# EAGLE design nceubadge (EAGLE 7.7.0)
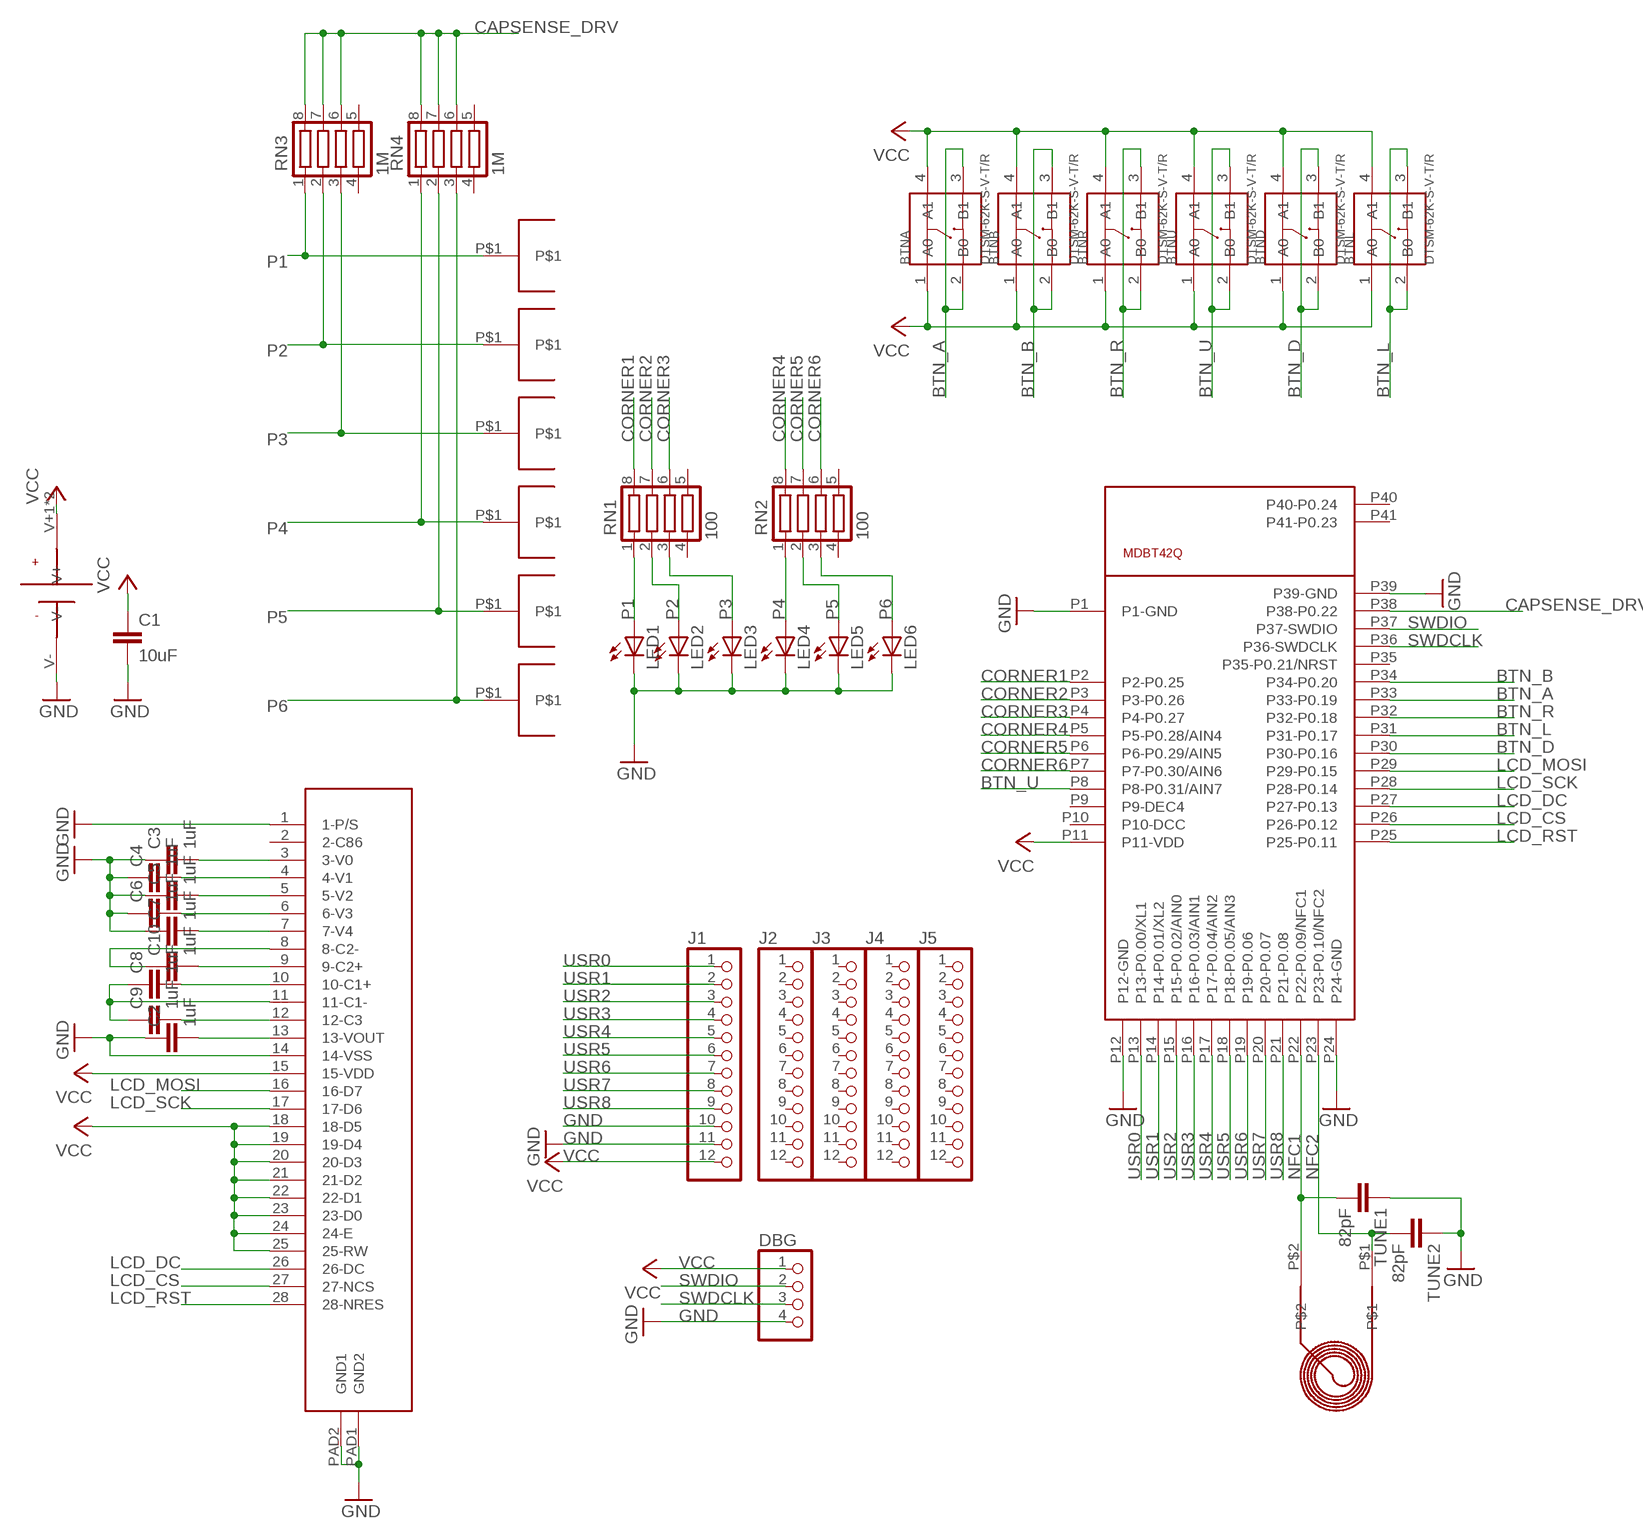
[diagram p0: schematic, sheet 1]

## Parts
BTNA  DTSM-62K-S-V-T/R  SMD-SWITCH-TACTILE-SPST-NO(4P-D6.0MM)  [SW4-SMD-6.0X6.0X5.0MM]
BTNB  DTSM-62K-S-V-T/R  SMD-SWITCH-TACTILE-SPST-NO(4P-D6.0MM)  [SW4-SMD-6.0X6.0X5.0MM]
BTND  DTSM-62K-S-V-T/R  SMD-SWITCH-TACTILE-SPST-NO(4P-D6.0MM)  [SW4-SMD-6.0X6.0X5.0MM]
BTNL  DTSM-62K-S-V-T/R  SMD-SWITCH-TACTILE-SPST-NO(4P-D6.0MM)  [SW4-SMD-6.0X6.0X5.0MM]
BTNR  DTSM-62K-S-V-T/R  SMD-SWITCH-TACTILE-SPST-NO(4P-D6.0MM)  [SW4-SMD-6.0X6.0X5.0MM]
BTNU  DTSM-62K-S-V-T/R  SMD-SWITCH-TACTILE-SPST-NO(4P-D6.0MM)  [SW4-SMD-6.0X6.0X5.0MM]
C1  10uF  C-EUC0805K  [C0805K]
C2  1uF  C-EUC0603  [C0603]
C3  1uF  C-EUC0603  [C0603]
C4  1uF  C-EUC0603  [C0603]
C5  1uF  C-EUC0603  [C0603]
C6  1uF  C-EUC0603  [C0603]
C7  1uF  C-EUC0603  [C0603]
C8  1uF  C-EUC0603  [C0603]
C9  1uF  C-EUC0603  [C0603]
C10  1uF  C-EUC0603  [C0603]
DBG  PINHD-1X4  [1X04]
J1  PINHD-1X12_2.54-S  [1X12-S]
J2  PINHD-1X12_2.54-S  [1X12-S]
J3  PINHD-1X12_2.54-S  [1X12-S]
J4  PINHD-1X12_2.54-S  [1X12-S]
J5  PINHD-1X12_2.54-S  [1X12-S]
J8  KEYSTONE-3003  [KEYSTONE-3003]
LCD  MCCOG128064B12W  [MCOG128064B12W-SPR]
LED1  LED5MM  [LED5MM]
LED2  LED5MM  [LED5MM]
LED3  LED5MM  [LED5MM]
LED4  LED5MM  [LED5MM]
LED5  LED5MM  [LED5MM]
LED6  LED5MM  [LED5MM]
RN1  100  CTS742C083  [CTS742C083]
RN2  100  CTS742C083  [CTS742C083]
RN3  1M  CTS742C083  [CTS742C083]
RN4  1M  CTS742C083  [CTS742C083]
TUNE1  82pF  C-EUC0603  [C0603]
TUNE2  82pF  C-EUC0603  [C0603]
U1  MDBT42Q  [MDBT40]
U$2  BANANAPLUG  [BANANAPLUG]
U$3  BANANAPLUG  [BANANAPLUG]
U$4  BANANAPLUG  [BANANAPLUG]
U$5  BANANAPLUG  [BANANAPLUG]
U$6  BANANAPLUG  [BANANAPLUG]
U$7  BANANAPLUG  [BANANAPLUG]
U$8  NFC  [NFC]

## Nets
BTN_A: BTNA.2(B0) BTNA.3(B1) U1.P33(P33-P0.19)
BTN_B: BTNB.2(B0) BTNB.3(B1) U1.P34(P34-P0.20)
BTN_D: BTND.2(B0) BTND.3(B1) U1.P30(P30-P0.16)
BTN_L: BTNL.2(B0) BTNL.3(B1) U1.P31(P31-P0.17)
BTN_R: BTNR.2(B0) BTNR.3(B1) U1.P32(P32-P0.18)
BTN_U: BTNU.2(B0) BTNU.3(B1) U1.P8(P8-P0.31/AIN7)
CAPSENSE_DRV: RN3.6 RN3.7 RN3.8 RN4.6 RN4.7 RN4.8 U1.P38(P38-P0.22)
CORNER1: RN1.8 U1.P2(P2-P0.25)
CORNER2: RN1.7 U1.P3(P3-P0.26)
CORNER3: RN1.6 U1.P4(P4-P0.27)
CORNER4: RN2.8 U1.P5(P5-P0.28/AIN4)
CORNER5: RN2.7 U1.P6(P6-P0.29/AIN5)
CORNER6: RN2.6 U1.P7(P7-P0.30/AIN6)
GND: C1.2 C2.1 C3.1 C4.1 C5.1 C6.1 C7.1 DBG.4 J1.10 J1.11 J8.V- LCD.1(1-P/S) LCD.14(14-VSS) LCD.PAD1(GND2) LCD.PAD2(GND1) LED1.K(C) LED2.K(C) LED3.K(C) LED4.K(C) LED5.K(C) LED6.K(C) TUNE1.1 TUNE2.1 U1.P1(P1-GND) U1.P12(P12-GND) U1.P24(P24-GND) U1.P39(P39-GND)
LCD_CS: LCD.27(27-NCS) U1.P26(P26-P0.12)
LCD_DC: LCD.26(26-DC) U1.P27(P27-P0.13)
LCD_MOSI: LCD.16(16-D7) U1.P29(P29-P0.15)
LCD_RST: LCD.28(28-NRES) U1.P25(P25-P0.11)
LCD_SCK: LCD.17(17-D6) U1.P28(P28-P0.14)
N$12: C8.1 C9.1 LCD.11(11-C1-)
N$13: C8.2 LCD.10(10-C1+)
N$14: C9.2 LCD.12(12-C3)
N$15: C2.2 LCD.13(13-VOUT)
N$16: C7.2 LCD.7(7-V4)
N$17: C6.2 LCD.6(6-V3)
N$18: C5.2 LCD.5(5-V2)
N$19: C4.2 LCD.4(4-V1)
N$20: C3.2 LCD.3(3-V0)
N$23: C10.2 LCD.9(9-C2+)
N$24: C10.1 LCD.8(8-C2-)
NFC1: TUNE1.2 U1.P22(P22-P0.09/NFC1) U$8.P$2
NFC2: TUNE2.2 U1.P23(P23-P0.10/NFC2) U$8.P$1
P1: LED1.A RN1.1 RN3.1 U$6.P$1
P2: LED2.A RN1.2 RN3.2 U$7.P$1
P3: LED3.A RN1.3 RN3.3 U$5.P$1
P4: LED4.A RN2.1 RN4.1 U$4.P$1
P5: LED5.A RN2.2 RN4.2 U$3.P$1
P6: LED6.A RN2.3 RN4.3 U$2.P$1
SWDCLK: DBG.3 U1.P36(P36-SWDCLK)
SWDIO: DBG.2 U1.P37(P37-SWDIO)
USR0: J1.1 U1.P13(P13-P0.00/XL1)
USR1: J1.2 U1.P14(P14-P0.01/XL2)
USR2: J1.3 U1.P15(P15-P0.02/AIN0)
USR3: J1.4 U1.P16(P16-P0.03/AIN1)
USR4: J1.5 U1.P17(P17-P0.04/AIN2)
USR5: J1.6 U1.P18(P18-P0.05/AIN3)
USR6: J1.7 U1.P19(P19-P0.06)
USR7: J1.8 U1.P20(P20-P0.07)
USR8: J1.9 U1.P21(P21-P0.08)
VCC: BTNA.1(A0) BTNA.4(A1) BTNB.1(A0) BTNB.4(A1) BTND.1(A0) BTND.4(A1) BTNL.1(A0) BTNL.4(A1) BTNR.1(A0) BTNR.4(A1) BTNU.1(A0) BTNU.4(A1) C1.1 DBG.1 J1.12 J8.V+1(V+) J8.V+2(V+) LCD.15(15-VDD) LCD.18(18-D5) LCD.19(19-D4) LCD.20(20-D3) LCD.21(21-D2) LCD.22(22-D1) LCD.23(23-D0) LCD.24(24-E) LCD.25(25-RW) U1.P11(P11-VDD)
Unconnected: J2.1 J2.2 J2.3 J2.4 J2.5 J2.6 J2.7 J2.8 J2.9 J2.10 J2.11 J2.12 J3.1 J3.2 J3.3 J3.4 J3.5 J3.6 J3.7 J3.8 J3.9 J3.10 J3.11 J3.12 J4.1 J4.2 J4.3 J4.4 J4.5 J4.6 J4.7 J4.8 J4.9 J4.10 J4.11 J4.12 J5.1 J5.2 J5.3 J5.4 J5.5 J5.6 J5.7 J5.8 J5.9 J5.10 J5.11 J5.12 LCD.2(2-C86) RN1.4 RN1.5 RN2.4 RN2.5 RN3.4 RN3.5 RN4.4 RN4.5 U1.P9(P9-DEC4) U1.P10(P10-DCC) U1.P35(P35-P0.21/NRST) U1.P40(P40-P0.24) U1.P41(P41-P0.23)

## Library data of the parts
BTNA BTNB BTND BTNL BTNR BTNU = Seeed-OPL-Button:SMD-SWITCH-TACTILE-SPST-NO(4P-D6.0MM): 311020004; MPN: DTSM-62K-S-V-T/R
C1-C10 TUNE1 TUNE2 = rcl:C-EU: CAPACITOR, European symbol
DBG = pinhead:PINHD-1X4: PIN HEADER
J1-J5 = pinhead-2:PINHD-1X12: PIN HEADER
J8 = cr2032:KEYSTONE-3003
LCD = midas:MCCOG128064B12W
LED1-LED6 = led:LED: LED OSRAM: - CHIPLED LG R971, LG N971, LY N971, LG Q971, LY Q971, LO R971, LY R971 LH N974, LH R974 LS Q976, LO Q976, LY Q976 LO Q996 - Hyper CHIPLED LW Q18S LB Q993, LB Q99A, LB R99A - SideLED LS A670, LO A670, LY A670, LG A670, LP A670 LB A673, LV A673, LT A673, LW A673 LH A674 LY A675 LS A676, LA A676, LO A676, LY A676, LW A676 LS A679, LY A679, LG A679 - Hyper Micro SIDELED® LS Y876, LA Y876, LO Y876, LY Y876 LT Y87S - SmartLED LW L88C, LW L88S LB L89C, LB L89S, LG L890 LS L89K, LO L89K, LY L89K LS L896, LA L896, LO L896, LY L896 - TOPLED LS T670, LO T670, LY T670, LG T670, LP T670 LSG T670, LSP T670, LSY T670, LOP T670, LYG T670 LG T671, LOG T671, LSG T671 LB T673, LV T673, LT T673, LW T673 LH T674 LS T676, LA T676, LO T676, LY T676, LB T676, LH T676, LSB T676, LW T676 LB T67C, LV T67C, LT T67C, LS T67K, LO T67K, LY T67K, LW E67C LS E67B, LA E67B, LO E67B, LY E67B, LB E67C, LV E67C, LT E67C LW T67C LS T679, LY T679, LG T679 LS T770, LO T770, LY T770, LG T770, LP T770 LB T773, LV T773, LT T773, LW T773 LH T774 LS E675, LA E675, LY E675, LS T675 LS T776, LA T776, LO T776, LY T776, LB T776 LHGB T686 LT T68C, LB T68C - Hyper Mini TOPLED® LB M676 - Mini TOPLED Santana® LG M470 LS M47K, LO M47K, LY M47K Source: http://www.osram.convergy.de LUXEON: - LUMILED® LXK2-PW12-R00, LXK2-PW12-S00, LXK2-PW14-U00, LXK2-PW14-V00 LXK2-PM12-R00, LXK2-PM12-S00, LXK2-PM14-U00 LXK2-PE12-Q00, LXK2-PE12-R00, LXK2-PE12-S00, LXK2-PE14-T00, LXK2-PE14-U00 LXK2-PB12-K00, LXK2-PB12-L00, LXK2-PB12-M00, LXK2-PB14-N00, LXK2-PB14-P00, LXK2-PB14-Q00 LXK2-PR12-L00, LXK2-PR12-M00, LXK2-PR14-Q00, LXK2-PR14-R00 LXK2-PD12-Q00, LXK2-PD12-R00, LXK2-PD12-S00 LXK2-PH12-R00, LXK2-PH12-S00 LXK2-PL12-P00, LXK2-PL12-Q00, LXK2-PL12-R00 Source: www.luxeon.com KINGBRIGHT: KA-3528ASYC Source: www.kingbright.com
RN1-RN4 = resistor-net:CTS742C083: Chip Resistor Array 4 Single Resistor Source: http://www.ctscorp.com/components/Datasheets/CTSChipArrayDs.pdf; OC_FARNELL: unknown; OC_NEWARK: unknown
U1 = mdbt42:MDBT42Q
U$2-U$7 = bananaplug:BANANAPLUG
U$8 = nfc:NFC

## Board
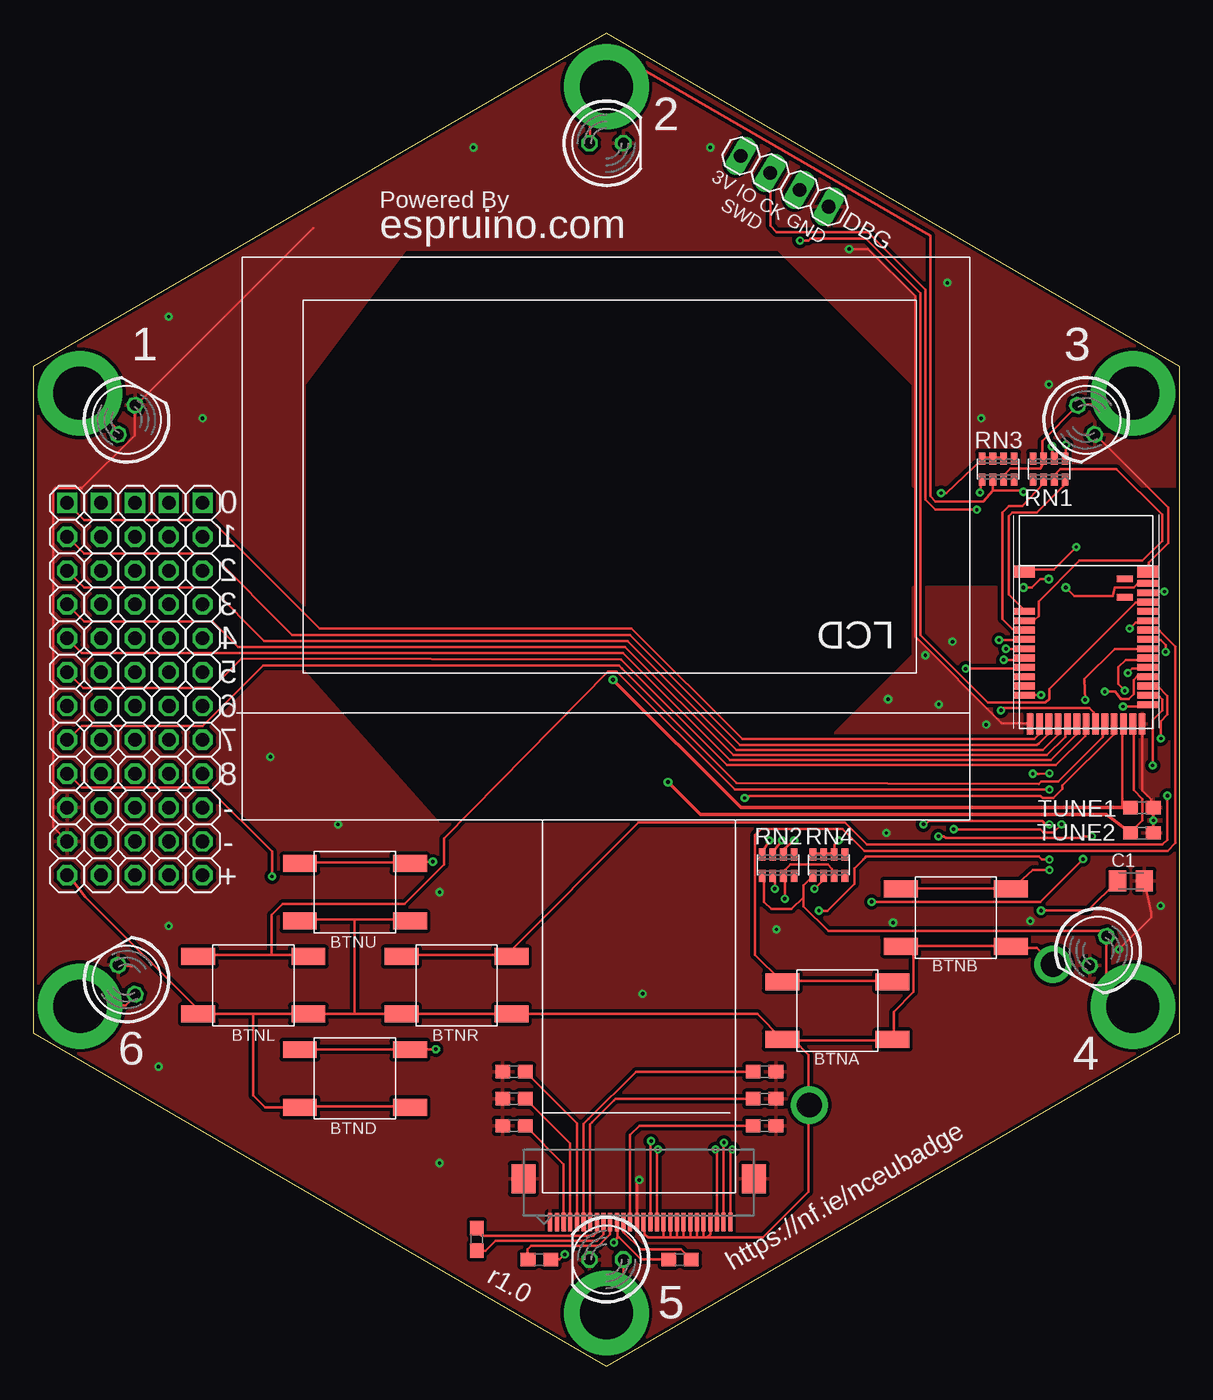
[diagram p1: board, top side]
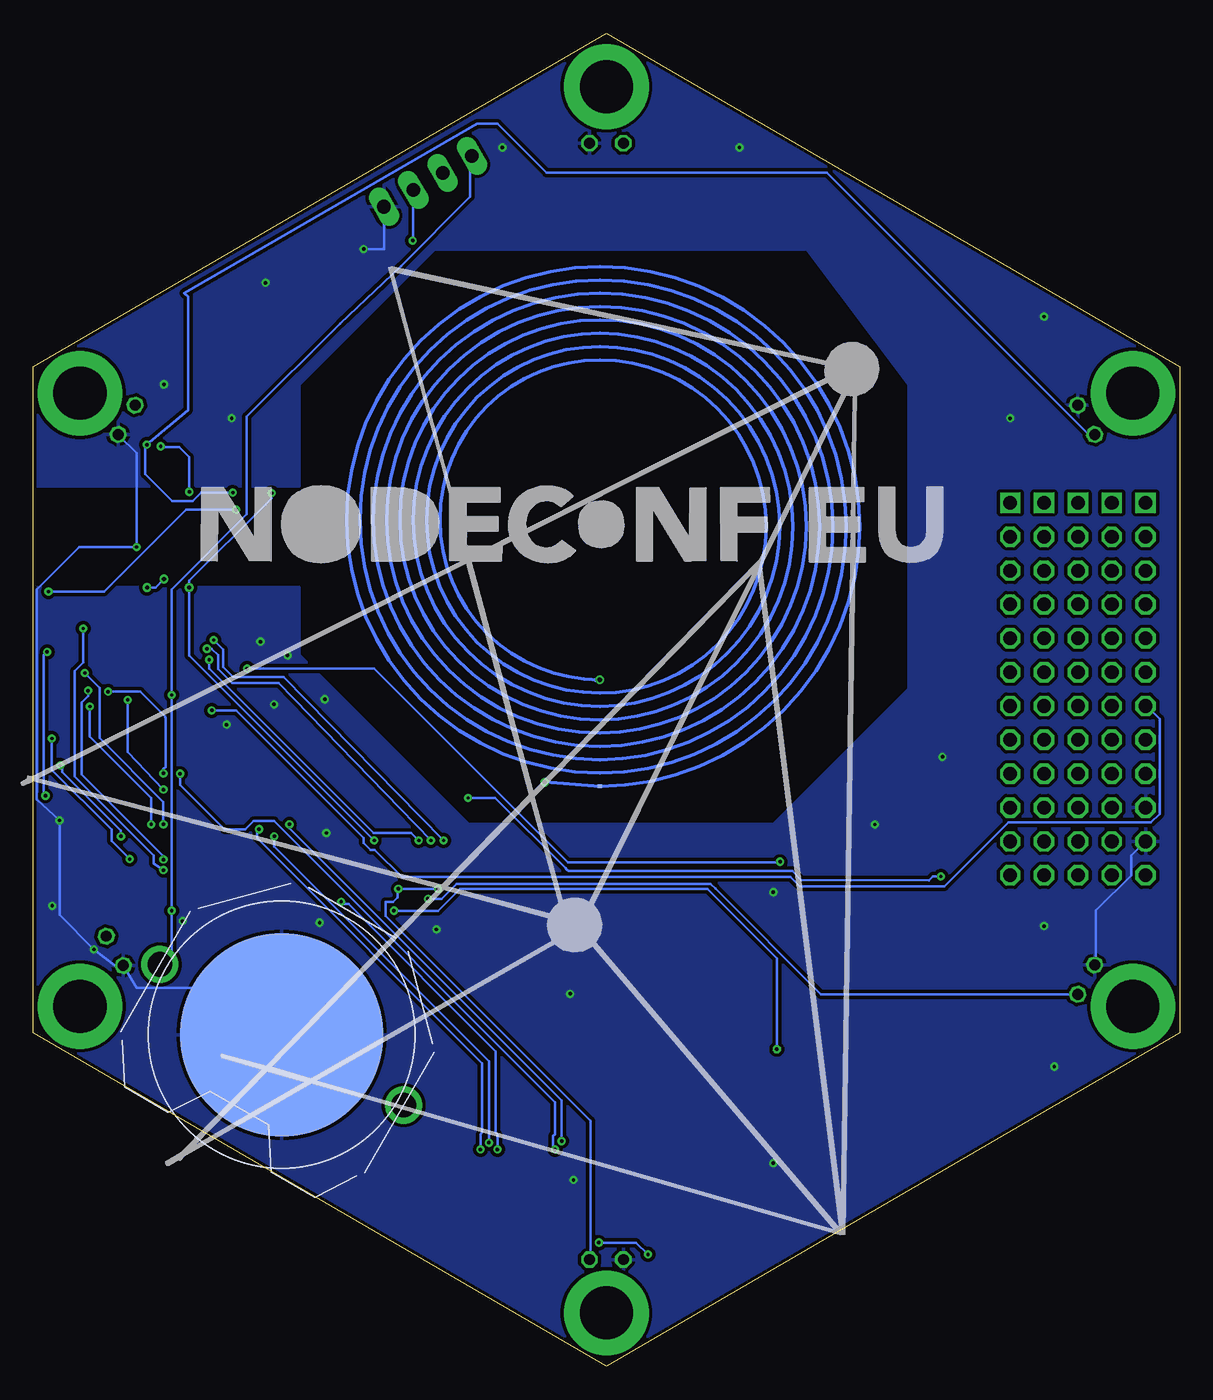
[diagram p2: board, bottom side, seen from below]

Size 86 x 100 mm. Coordinates in mm from the lower left corner, seen from the top.
Outline: 43,0 86,25 86,75 43,100 0,75 0,25 43,0
Copper layers (1*16): Top 0.035559375mm / dielectric 0.17018125mm / Bottom 0.035559375mm
Design rules "espruino *": minimum track width 8mil, minimum drill 10mil, track to track 6mil, track to pad 6mil, pad to pad 6mil, via to via 6mil, smd to smd 0mil, copper to edge 6mil, drill to drill 6mil, minimum pad ring 7mil, minimum via ring 7mil, stop-mask expansion 6mil, vias tented up to drill 15mil, thermal gap 10mil

### Footprints (pad centres in the part's own frame; a part is rotated, then mirrored left to right if it is on the bottom)
SW4-SMD-6.0X6.0X5.0MM = smd 2.54 x 1.27: 1 -4.129,2.159; 2 -4.129,-2.159; 3 4.129,-2.159; 4 4.129,2.159
C0805K = smd 1.3 x 1.6: 1 -1,0; 2 1,0
C0603 = smd 1.1 x 1: 1 -0.85,0; 2 0.85,0
1X04 = drill 1.016 long: 1 -3.81,0; 2 -1.27,0; 3 1.27,0; 4 3.81,0
1X12-S = drill 1.016 square: 1 -13.97,0 | drill 1.016 octagon: 2 -11.43,0; 3 -8.89,0; 4 -6.35,0; 5 -3.81,0; 6 -1.27,0; 7 1.27,0; 8 3.81,0; 9 6.35,0; 10 8.89,0; 11 11.43,0; 12 13.97,0
KEYSTONE-3003 = drill 1.854: V+1 -10.554,0; V+2 10.554,0 | smd 15.24 x 15.24: V- 0,0
MCOG128064B12W-SPR = smd 0.305 x 1.397: 1 31.466,30.191; 2 30.958,30.191; 3 30.45,30.191; 4 29.968,30.191; 5 29.46,30.191; 6 28.952,30.191; 7 28.469,30.191; 8 27.961,30.191; 9 27.453,30.191; 10 26.971,30.191; 11 26.463,30.191; 12 25.955,30.191; 13 25.472,30.191; 14 24.964,30.191; 15 24.456,30.191; 16 23.948,30.191; 17 23.465,30.191; 18 22.957,30.191; 19 22.449,30.191; 20 21.967,30.191; 21 21.459,30.191; 22 20.951,30.191; 23 20.468,30.191; 24 19.96,30.191; 25 19.452,30.191; 26 18.97,30.191; 27 18.462,30.191; 28 17.954,30.191 | smd 1.8 x 2.2: PAD1 16.17,26.94; PAD2 33.47,26.94
LED5MM = drill 0.813 octagon: A -1.27,0; K 1.27,0
CTS742C083 = smd 0.5 x 0.9: 1 -1.2,-0.8; 2 -0.4,-0.8; 3 0.4,-0.8; 4 1.2,-0.8; 5 1.2,0.8; 6 0.4,0.8; 7 -0.4,0.8; 8 -1.2,0.8
MDBT40 = smd 1.6 x 0.9: P1 -4.65,3.8; P39 4.65,3.8 | smd 1.6 x 0.5: P2 -4.65,0.8; P3 -4.65,0.1; P4 -4.65,-0.6; P5 -4.65,-1.3; P6 -4.65,-2; P7 -4.65,-2.7; P8 -4.65,-3.4; P9 -4.65,-4.1; P10 -4.65,-4.8; P11 -4.65,-5.5; P25 4.65,-6.2; P26 4.65,-5.5; P27 4.65,-4.8; P28 4.65,-4.1; P29 4.65,-3.4; P30 4.65,-2.7; P31 4.65,-2; P32 4.65,-1.3; P33 4.65,-0.6; P34 4.65,0.1; P35 4.65,0.8; P36 4.65,1.5; P37 4.65,2.2; P38 4.65,2.9 | smd 0.5 x 1.6: P12 -4.2,-7.65; P13 -3.5,-7.65; P14 -2.8,-7.65; P15 -2.1,-7.65; P16 -1.4,-7.65; P17 -0.7,-7.65; P18 0,-7.65; P19 0.7,-7.65; P20 1.4,-7.65; P21 2.1,-7.65; P22 2.8,-7.65; P23 3.5,-7.65; P24 4.2,-7.65 | smd 1.2 x 0.5: P40 2.9,3.25; P41 2.9,1.85
BANANAPLUG = drill 4 pad 6.35: P$1 0,0
NFC = smd 0.305 x 0.254: P$1 0,-20; P$2 0,-12

### Placement (x,y rotation side)
BTNA  60.33,26.67 180 top
BTNB  69.22,33.66 180 top
BTND  24.13,21.59 180 top
BTNL  16.51,28.57 180 top
BTNR  31.75,28.57 180 top
BTNU  24.13,35.56 180 top
C1  82.35,36.41 0 top
C2  54.86,18.03 180 top
C3  36.07,18.03 0 top
C4  36.07,20.07 0 top
C5  36.07,22.1 0 top
C6  54.86,22.1 180 top
C7  54.86,20.07 180 top
C8  37.97,8 180 top
C9  48.51,8 0 top
C10  33.27,9.53 270 top
DBG  56.39,88.9 330 top
J1  2.54,50.8 270 top
J2  5.08,50.8 270 top
J3  7.62,50.8 270 top
J4  10.16,50.8 270 top
J5  12.7,50.8 270 top
J8  67.36,24.86 330 bottom
LCD  70.25,41 180 top
LED1  7,71 60 top
LED2  43,91.75 0 top
LED3  79,71 300 top
LED4  79.89,31.16 240 top
LED5  43,8 180 top
LED6  7,29 120 top
RN1  76.2,67.31 180 top
RN2  55.88,37.59 0 top
RN3  72.39,67.31 0 top
RN4  59.69,37.59 0 top
TUNE1  83.19,41.91 180 top
TUNE2  83.19,40.01 180 top
U1  78.99,55.83 0 top
U$2  3.5,27 0 top
U$3  43,4 0 top
U$4  82.5,27 0 top
U$5  82.5,73 0 top
U$6  3.5,73 0 top
U$7  43,96 0 top
U$8  43.5,63.5 0 bottom

### Tracks (layer width: path | path; a pad name or v marks a point on that pad's centre or on a via)
BTN_A
  Top 0.203: U1.P33 83.71,55.14 84.53,55.14 85.69,53.99 85.69,39.24 85.11,38.67 62.37,38.67 60.72,40.32 54.63,40.32 54.15,39.84 54.15,30.87 56.13,28.89 BTNA.3 56.3,28.89 64.39,28.89 BTNA.2
BTN_B  (via drill 0.25)
  Top 0.203: v82.26,55.35 82.72,55.8 83.54,55.8 U1.P34 | v76.24,37.22 74.99,37.22 73.47,35.83 BTNB.2 73.3,35.83 65.22,35.83 BTNB.3
  Bottom 0.203: v82.26,55.35 82.26,52.79 82.88,52.17 82.88,44.25 76.96,38.33 76.96,37.72 76.24,37.25 v76.24,37.22
BTN_D  (via drill 0.25)
  Top 0.203: v76.24,38.01 75.65,38.01 75.44,38.23 62.48,38.23 62.4,38.14 62.29,38.04 61.59,37.34 61.59,36.2 59.56,34.16 58.95,34.16 v58.94,34.18 | U1.P30 83.54,53 81.95,53 81.41,52.45 81.41,51.17 v81.89,50.69 | BTND.3 20.47,23.77 27.74,23.77 27.76,23.75 BTND.2 28.28,23.77 v30.21,23.77
  Bottom 0.203: v81.89,50.69 81.89,50.28 82.39,49.78 82.39,44.41 76.24,38.27 v76.24,38.01 | v30.21,23.77 30.21,30.59 35.43,35.81 53.98,35.81 55.63,34.16 58.93,34.16 v58.94,34.18
BTN_L  (via drill 0.25)
  Top 0.203: v78.92,49.99 78.87,51.56 81.13,53.82 83.54,53.82 U1.P31 | v76.24,43.26 52.63,43.26 43.75,52.13 43.13,52.13 30.84,39.59 30.84,37.66 27.85,34.67 18.71,34.67 17.88,33.85 17.88,30.87 | BTNL.2 20.14,30.87 17.88,30.87 | 17.88,30.87 12.88,30.87 BTNL.3
  Bottom 0.203: v78.92,49.99 78.92,46.06 v76.24,43.26
BTN_R  (via drill 0.25)
  Top 0.203: U1.P32 83.71,54.48 84.58,54.48 84.96,54.1 v84.96,53.59 | BTNR.3 28.07,30.87 35.33,30.87 BTNR.2 35.5,30.87 45.4,40.78 60.88,40.78 62.53,39.13 84.72,39.13 85.09,39.5 v85.09,42.8
  Bottom 0.203: v84.96,53.59 85.22,53.34 85.22,42.93 v85.09,42.8
BTN_U  (via drill 0.25)
  Top 0.203: v69.96,52.34 74.3,52.34 U1.P8 | BTNU.3 20.47,37.81 28.17,37.81 BTNU.2 28.39,37.85 v29.97,37.85
  Bottom 0.203: v69.96,52.34 60.43,52.34 45.9,37.81 30.01,37.81 v29.97,37.85
CAPSENSE_DRV  (via drill 0.25, 0.3)
  Top 0.203: RN4.8 58.61,38.46 59.27,38.46 RN4.7 59.44,38.46 59.93,38.46 RN4.6 60.1,38.46 60.1,39.12 v60.43,39.45 | RN3.6 72.64,68.19 72.15,68.19 RN3.7 71.98,68.19 71.32,68.19 RN3.8 71.16,68.02 68.52,65.51 v68.11,65.51 | U1.P38 82.86,58.73 82.55,58.42 81.15,58.42 80.97,57.78 78.11,57.78 v77.47,58.42 | v76.2,59.05 75.56,59.05 74.93,58.42 v74.3,58.42
  Bottom 0.203: v68.11,65.51 68.11,65.11 68.58,64.64 74.3,58.94 v74.3,58.42 74.3,53.31 v60.43,39.45 | v77.47,58.42 76.83,58.42 v76.2,59.05
CORNER1
  Top 0.203: RN1.8 77.27,66.37 77.27,66.04 75.29,64.06 73.47,64.06 73.18,63.77 73.18,57.91 74.3,56.79 U1.P2
CORNER2
  Top 0.203: RN1.7 76.61,66.53 76.61,66.86 77.06,67.32 81.27,67.32 84.7,63.89 84.7,61.91 83.21,60.43 78.5,60.43 75.45,57.38 75.45,56.3 75.12,55.97 74.46,55.97 U1.P3
CORNER3
  Top 0.203: RN1.6 75.78,66.37 75.78,66.2 74.22,64.52 73.18,64.52 72.72,64.06 72.72,56.06 73.47,55.31 74.3,55.31 U1.P4
CORNER4  (via drill 0.25)
  Top 0.203: v55.22,39.45 54.81,38.79 54.81,38.46 RN2.8 | v72.47,54.48 74.3,54.48 U1.P5
  Bottom 0.203: v55.22,39.45 67.23,51.71 71.02,51.71 71.75,52.45 71.75,53.77 v72.47,54.48
CORNER5  (via drill 0.25)
  Top 0.203: v56.17,39.45 55.64,38.79 55.64,38.46 RN2.7 | v72.97,53.82 74.3,53.82 U1.P6
  Bottom 0.203: v56.17,39.45 67.6,51.26 71.07,51.26 72.14,52.32 72.14,53.34 72.62,53.82 v72.97,53.82
CORNER6  (via drill 0.25)
  Top 0.203: v57.09,39.45 56.3,38.79 56.3,38.46 RN2.6 | v72.81,53 74.3,53 U1.P7
  Bottom 0.203: v57.09,39.45 57.65,40.01 60.45,40.01 72.81,52.36 v72.81,53
GND  (via drill 0.25)
  Top 0.203: U1.P12 74.62,48.21 72.64,48.26 66.17,54.74 66.17,80.26 62.61,83.82 v61.21,83.82 | 44.41,91.63 LED2.K | J1.11 2.48,39.46 1.49,40.45 1.49,65.71 1.65,65.88 3.63,65.88 7.59,69.84 7.59,71.98 LED1.K 7.76,72.15 21,85.38 | v78.26,61.45 76.57,59.77 74.46,59.77 U1.P1 | U1.P39 83.71,59.77 83.71,60.3 85.15,61.75 85.15,64.43 79.74,69.84 LED3.K | TUNE2.1 84.04,40.12 v84.04,40.95 84.04,41.77 TUNE1.1 83.87,41.94 83.87,42.52 83.21,43.18 83.21,48.04 U1.P24 | v81.46,31.27 83.87,33.68 83.87,34.01 C1.2 | 79.15,30.18 LED4.K | 7.43,30.05 6.44,30.05 LED6.K | LCD.14 45.29,13.79 v45.47,13.97
  Bottom 0.203: LED6.K 6.27,30.21 6.27,34.18 3.63,36.82 3.63,38.3 2.64,39.29 J1.11 | LED3.K 79.58,69.84 78.26,68.52 v78.26,61.45 82.56,61.45 85.74,58.28 85.74,42.52 v84.04,40.95 84.04,33.85 v81.46,31.27 79.9,30.09 79.57,30.09 LED4.K 78.26,28.4 70.99,28.4 67.53,24.93 J8.V- | v61.21,83.82 59.69,83.82 DBG.4
  other vias: 76.2,73.66 68.58,81.28 71.12,71.12 50.8,91.44 33.02,91.44 12.7,71.12 10.16,78.74 17.78,45.72 22.86,40.64 30.48,35.56 45.72,27.94 30.48,15.24 10.16,33.02 68.96,54.36 64.14,50.04 67.94,49.66 71.5,48.13 64.01,40.01 55.75,32.77 64.52,33.27 66.93,53.34 74.8,33.4 84.58,34.54 9.4,22.48
  pour Bottom (isolate 0.254): -5.71,100.97 88.9,100.97 88.9,66.04 66.04,66.04 66.04,73.66 55.88,83.82 27.94,83.82 20.32,73.66 20.32,50.8 30.48,40.64 53.34,40.64 66.04,53.34 66.04,58.42 88.9,58.42 88.9,-3.81 -5.71,-3.81
  pour Top (isolate 0.254): -5.71,100.97 88.9,100.97 88.9,66.04 66.04,66.04 66.04,73.66 55.88,83.82 27.94,83.82 20.32,73.66 20.32,52.07 30.48,40.64 53.34,40.64 66.04,53.34 66.04,58.42 88.9,58.42 88.9,-3.81 -5.71,-3.81
LCD_CS  (via drill 0.25)
  Top 0.203: v79.43,39.75 78.87,39.75 78.74,39.62 68.45,39.62 68.33,39.75 v67.92,39.75 | v83.98,45.07 83.98,48.49 84.7,49.2 84.7,50.02 84.53,50.19 83.71,50.19 U1.P26 | LCD.27 51.79,16.74 v51.82,16.76
  Bottom 0.203: v51.82,16.76 51.82,22.86 67.94,38.99 67.94,39.6 v67.92,39.75 | v79.43,39.75 79.43,40.18 83.82,44.58 83.82,44.91 v83.98,45.07
LCD_DC  (via drill 0.25)
  Top 0.203: v62.9,34.84 75.55,34.84 v78.77,38.05 | v84.61,47.09 84.58,48.39 85.09,48.9 85.09,50.29 84.37,51.02 83.71,51.02 U1.P27 | LCD.26 51.28,16.23 v51.18,16.26
  Bottom 0.203: v51.18,16.26 51.18,17.4 51.31,17.53 51.31,23.62 62.36,34.67 62.74,34.67 v62.9,34.84 | v84.61,47.09 84.61,44.73 80.14,40.26 80.14,39.42 v78.77,38.05
LCD_MOSI  (via drill 0.25)
  Top 0.203: v76.24,40.65 75.93,40.65 75.69,40.89 67.18,40.89 66.94,40.65 v66.79,40.65 | v82.13,52.01 82.46,52.34 83.54,52.34 U1.P29 | LCD.16 46.3,16.84 v46.35,16.89
  Bottom 0.203: v76.24,40.65 76.24,42.34 81.01,47.12 81.01,50.89 v82.13,52.01 | v46.35,16.89 46.35,19.94 66.79,40.37 v66.79,40.65
LCD_RST  (via drill 0.25)
  Top 0.203: v69.06,40.28 69.75,40.28 69.85,40.26 75.56,40.26 75.79,40.03 76.53,40.03 v77.15,40.65 | v81.76,49.49 83.38,49.49 83.54,49.53 U1.P25 | LCD.28 52.3,16.23 v52.45,16.26
  Bottom 0.203: v77.15,40.65 77.15,42.63 81.76,47.24 v81.76,49.49 | v52.45,16.26 52.45,17.4 52.32,17.53 52.32,22.73 69.22,39.62 69.22,40.26 v69.06,40.28
LCD_SCK  (via drill 0.25)
  Top 0.203: v74.99,44.45 75.45,44.45 v76.24,44.48 | v80.39,50.61 81.18,50.61 81.6,50.06 82.18,50.06 82.55,50.43 82.55,51.47 82.88,51.8 83.54,51.68 U1.P28 | LCD.17 46.78,16.18 v46.86,16.26
  Bottom 0.203: v74.99,44.45 74.99,43.62 71.65,40.28 71.49,40.28 71.46,40.26 70.1,40.26 69.47,40.89 67.94,40.89 46.86,19.81 46.86,17.4 46.99,17.27 46.99,16.51 46.86,16.38 v46.86,16.26 | v76.24,44.48 76.24,44.79 76.07,44.96 76.07,48.64 76.11,48.68 76.11,48.73 77.99,50.61 v80.39,50.61
N$12  (via drill 0.25)
  Top 0.203: C8.1 39.5,8 v39.88,8.38 | v43.56,9.27 43.81,9.65 | 43.81,9.65 43.81,10.78 LCD.11 | 43.81,9.65 43.94,9.65 45.59,8 C9.1
  Bottom 0.203: v39.88,8.38 40.77,9.27 v43.56,9.27
N$13
  Top 0.203: LCD.10 43.28,9.88 42.42,9.02 37.34,9.02 37.08,8.76 37.08,8.04 C8.2
N$14
  Top 0.203: LCD.12 44.3,10.06 45.59,8.76 48.6,8.76 C9.2
N$15
  Top 0.203: C2.2 45.47,18.03 44.78,17.35 LCD.13
N$16
  Top 0.203: C7.2 43.69,20.07 43.56,19.94 41.91,18.29 41.78,18.16 LCD.7
N$17
  Top 0.203: C6.2 45.21,22.1 41.66,18.54 41.3,18.18 LCD.6
N$18
  Top 0.203: C5.2 40.79,18.23 LCD.5
N$19
  Top 0.203: C4.2 40.28,16.7 LCD.4
N$20
  Top 0.203: C3.2 39.8,15.15 LCD.3
N$23
  Top 0.203: C10.2 33.95,8.68 34.67,9.4 42.29,9.4 42.8,9.91 LCD.9
N$24
  Top 0.203: LCD.8 42.29,10.03 42.04,9.78 33.62,9.78 C10.1
NFC1  (via drill 0.3)
  Top 0.203: 81.72,41.91 81.72,48.04 U1.P22
  Top 0.254: TUNE1.2 81.72,41.91 53.09,41.91 U$8.P$2
  Bottom 0.254: U$8.P$2 43.56,51.44 43.81,51.44 43.75,51.5 U$8.P$2
  other vias: 43.5,51.5
NFC2  (via drill 0.3)
  Top 0.203: U1.P23 82.55,48.04 82.55,43.22 83.21,42.56 83.21,40.95 82.39,40.12 TUNE2.2
  Top 0.254: v47.62,43.81 50.04,41.4 80.52,41.4 TUNE2.2
  Bottom 0.254: U$8.P$1 v47.62,43.81
P1  (via drill 0.25)
  Top 0.203: v71.03,65.55 71.16,66.37 RN3.1 | v77.48,69.14 77.48,68.48 77.27,68.19 RN1.1 | LED1.A 6.27,70 6.27,70.33 3.63,72.97 U$6.P$1
  Bottom 0.203: LED1.A 6.44,70 6.93,70 26.47,89.53 47.5,89.53 51.18,93.22 52.7,93.22 74.68,80.52 74.39,80.23 74.39,71.72 v77.48,69.14 77.6,69.03 77.6,66.93 75.56,64.9 74.04,64.9 73.39,65.55 v71.03,65.55
P2  (via drill 0.25)
  Top 0.203: 71.98,65.71 71.98,66.37 RN3.2 | 71.98,65.71 71.28,64.88 67.69,64.88 67.31,65.27 67.31,84.84 45.97,97.16 42.65,95.65 | 43.09,95.92 U$7.P$1 42.93,95.92 42.65,95.65 | v76.44,69.01 76.44,68.19 RN1.2 | v74.3,65.6 74.17,65.66 73.97,65.71 71.98,65.71 | 42.65,95.65 41.77,94.77 41.77,91.8 LED2.A
  Bottom 0.203: v74.3,65.6 74.3,68.2 75.06,68.96 76.39,68.96 v76.44,69.01
P3
  Top 0.203: RN3.3 72.81,66.53 72.81,66.86 73.3,67.36 75.54,67.36 75.95,68.02 RN1.3 75.69,68.06 75.69,69.42 78.26,71.98 LED3.A 78.42,72.15 81.56,72.15 82.39,72.97 U$5.P$1
P4
  Top 0.203: RN2.1 54.81,36.64 54.81,34.85 55.37,34.29 56.9,34.29 57.78,35.18 | 58.45,36.64 RN4.1 57.78,36.09 57.78,35.18 | U$4.P$1 82.39,27.08 80.5,28.96 80.5,29.95 LED4.A 80.14,32.64 59.65,32.64 57.78,34.51 57.78,35.18
P5  (via drill 0.25)
  Top 0.203: v55.64,35.81 55.64,36.64 RN2.2 | v58.61,35.81 59.44,36.64 RN4.2 | LED5.A 44.27,5.27 U$3.P$1
  Bottom 0.203: v55.64,35.81 v58.61,35.81 58.67,35.75 58.67,35.18 59,34.85 59.56,34.85 59.56,33.78 44.2,18.41 44.2,8.07 LED5.A
P6  (via drill 0.25)
  Top 0.203: RN4.3 59.93,36.8 59.93,37.3 59.6,37.63 56.79,37.63 56.3,37.13 56.3,36.8 RN2.3 56.39,36.64 v56.39,35.06 | U$2.P$1 3.63,27.08 6.93,27.08 7.59,27.74 LED6.A
  Bottom 0.203: LED6.A 7.76,27.9 26.91,27.9 34.84,35.83 34.84,35.85 35.18,36.2 54.23,36.2 55.37,35.05 56.38,35.05 v56.39,35.06
SWDCLK  (via drill 0.25)
  Top 0.203: U1.P36 83.54,57.29 82.72,57.29 76.24,50.81 76.24,50.06 75.95,49.78 71.63,49.78 66.55,54.86 66.55,80.52 62.48,84.58 58.29,84.58 58.17,84.45 v57.53,84.45
  Bottom 0.203: v57.53,84.45 57.49,84.62 DBG.3
SWDIO  (via drill 0.25)
  Top 0.203: v84.86,58.12 83.71,58.12 U1.P37 | v70.79,64.26 67.69,64.26 66.93,65.02 66.93,80.77 62.61,85.09 55.75,85.09 55.29,85.56 DBG.2
  Bottom 0.203: v84.86,58.12 80.68,58.12 74.54,64.26 v70.79,64.26
USR0
  Top 0.203: U1.P13 75.45,48.04 75.45,47.38 75.12,47.05 53.19,47.05 44.9,55.35 21.49,55.35 13.34,63.5 3.81,63.5 J1.1 2.64,64.72
USR1
  Top 0.203: U1.P14 76.11,48.04 76.11,47.38 75.45,46.72 75.42,46.72 75.31,46.61 53.01,46.61 44.76,54.86 19.43,54.86 13.34,60.96 3.81,60.96 J1.2 2.64,62.08
USR2
  Top 0.203: U1.P15 76.77,48.04 76.9,47.38 75.74,46.23 52.77,46.23 44.58,54.42 17.34,54.42 13.34,58.42 3.81,58.42 J1.3 2.64,59.6
USR3
  Top 0.203: U1.P16 77.43,48.04 77.43,47.22 76.06,45.85 52.53,45.85 44.4,53.98 15.37,53.98 13.46,55.88 3.81,55.88 J1.4 2.64,57.12
USR4
  Top 0.203: U1.P17 78.26,48.04 78.26,47.38 76.34,45.47 52.29,45.47 44.26,53.49 3.63,53.49 2.64,54.48 J1.5
USR5
  Top 0.203: J1.6 3.76,50.88 13.41,50.88 15.62,53.09 44.09,53.03 52.03,45.1 76.72,45.1 78.92,47.3 78.92,48.04 U1.P18
USR6  (via drill 0.25)
  Top 0.203: v72.61,49.2 72.77,49.37 79.25,49.37 79.58,49.03 79.58,48.21 U1.P19
  Bottom 0.203: v72.61,49.2 70.79,49.2 61.21,39.62 61.21,39.24 60.71,38.73 60.38,38.73 58.34,36.7 29.21,36.7 28.5,35.99 17.63,35.99 12.84,40.78 2.15,40.78 1.49,41.44 1.49,48.54 2.48,49.53 J1.7
USR7
  Top 0.203: U1.P20 80.24,48.04 80.24,47.22 76.9,43.88 75.63,43.88 75.44,43.69 52.76,43.75 44.17,52.34 44.17,52.35 43.94,52.58 17.25,52.58 12.71,48.04 3.63,48.04 2.64,47.05 J1.8
USR8  (via drill 0.25)
  Top 0.203: v53.38,42.63 53.56,42.63 53.72,42.8 75.56,42.8 75.73,42.63 76.54,42.63 77.22,43.31 77.22,43.56 81.06,47.38 81.06,48.04 U1.P21 | J1.9 2.64,44.41 3.63,43.42 13.09,43.42 17.91,38.61 v17.91,36.74
  Bottom 0.203: v53.38,42.63 51.35,42.63 46.08,37.36 45.99,37.27 45.86,37.15 29.06,37.15 28.4,36.49 18.8,36.45 18.5,36.74 v17.91,36.74
VCC  (via drill 0.25)
  Top 0.203: 24.11,33.52 27.74,33.52 BTNU.1 | 24.11,33.52 20.47,33.52 BTNU.4 | BTND.1 27.74,19.48 20.05,19.48 BTND.4 17.4,19.43 16.51,20.32 16.51,26.42 | J1.12 2.64,36.82 3.91,35.22 12.71,26.42 BTNL.4 16.51,26.42 | 16.51,26.42 BTNL.1 24.11,26.42 | 24.11,26.42 BTNR.4 BTNR.1 54.32,26.42 56.13,24.6 BTNA.4 | 24.11,26.42 24.11,33.52 | 56.3,24.43 BTNA.4 | 66.04,31.53 73.3,31.53 BTNB.1 73.47,31.37 75.29,31.37 76.44,30.21 J8.V+1 | 66.04,31.53 65.22,31.53 BTNB.4 66.04,31.53 | v75.62,50.35 74.46,50.35 U1.P11 | v75.62,34.18 79.12,34.18 C1.1 | 66.04,31.53 66.04,28.07 64.55,26.58 64.55,24.6 BTNA.1 64.39,24.43 57.1,24.43 | 50.55,9.65 50.29,9.65 | 50.29,9.65 49.78,9.65 | 49.78,9.65 49.28,9.65 | 49.28,9.65 48.77,9.65 | 48.77,9.65 48.39,9.65 | 48.39,9.65 47.88,9.65 | 47.88,9.65 47.24,9.65 | 47.24,9.65 46.1,9.65 45.85,9.91 45.85,10.76 LCD.15 | LCD.18 47.29,9.7 47.24,9.65 | LCD.19 47.8,9.73 47.88,9.65 | LCD.20 48.28,9.76 48.39,9.65 | LCD.21 48.79,9.68 48.77,9.65 | LCD.22 49.3,9.68 49.28,9.65 | LCD.23 49.78,9.65 | LCD.24 50.29,9.65 | LCD.25 50.8,9.9 50.55,9.65 | 50.55,9.65 54.74,9.65 58.17,13.08 58.17,19.53 J8.V+2 58.17,19.65 58.17,23.37 57.1,24.43 | 56.3,24.43 56.27,24.43 BTNA.4 | 56.3,24.43 57.1,24.43
  Bottom 0.203: J8.V+1 76.44,30.21 75.62,31.04 v75.62,34.18 v75.62,50.35 75.62,58.28 69.98,63.92 69.98,71.25 62.99,78.23 58.42,82.55 53.21,87.76 53.21,90.68 DBG.1

### Text on the board
tNames: 2 | Powered By | 3V IO CK GND / SWD | espruino.com | 1 | 3 | 0 / 1 / 2 / 3 / 4 / 5 / 6 / 7 / 8 / - / - / + | 6 | 4 | https://nf.ie/nceubadge | r1.0 | 5